# EasyEDA schematic schematic.json
TITLE: Sheet_1; REV: 1.0; Date: 2024-08-02; Sheet: 1/1; Drawn By: aminashellman; Company: Your Company
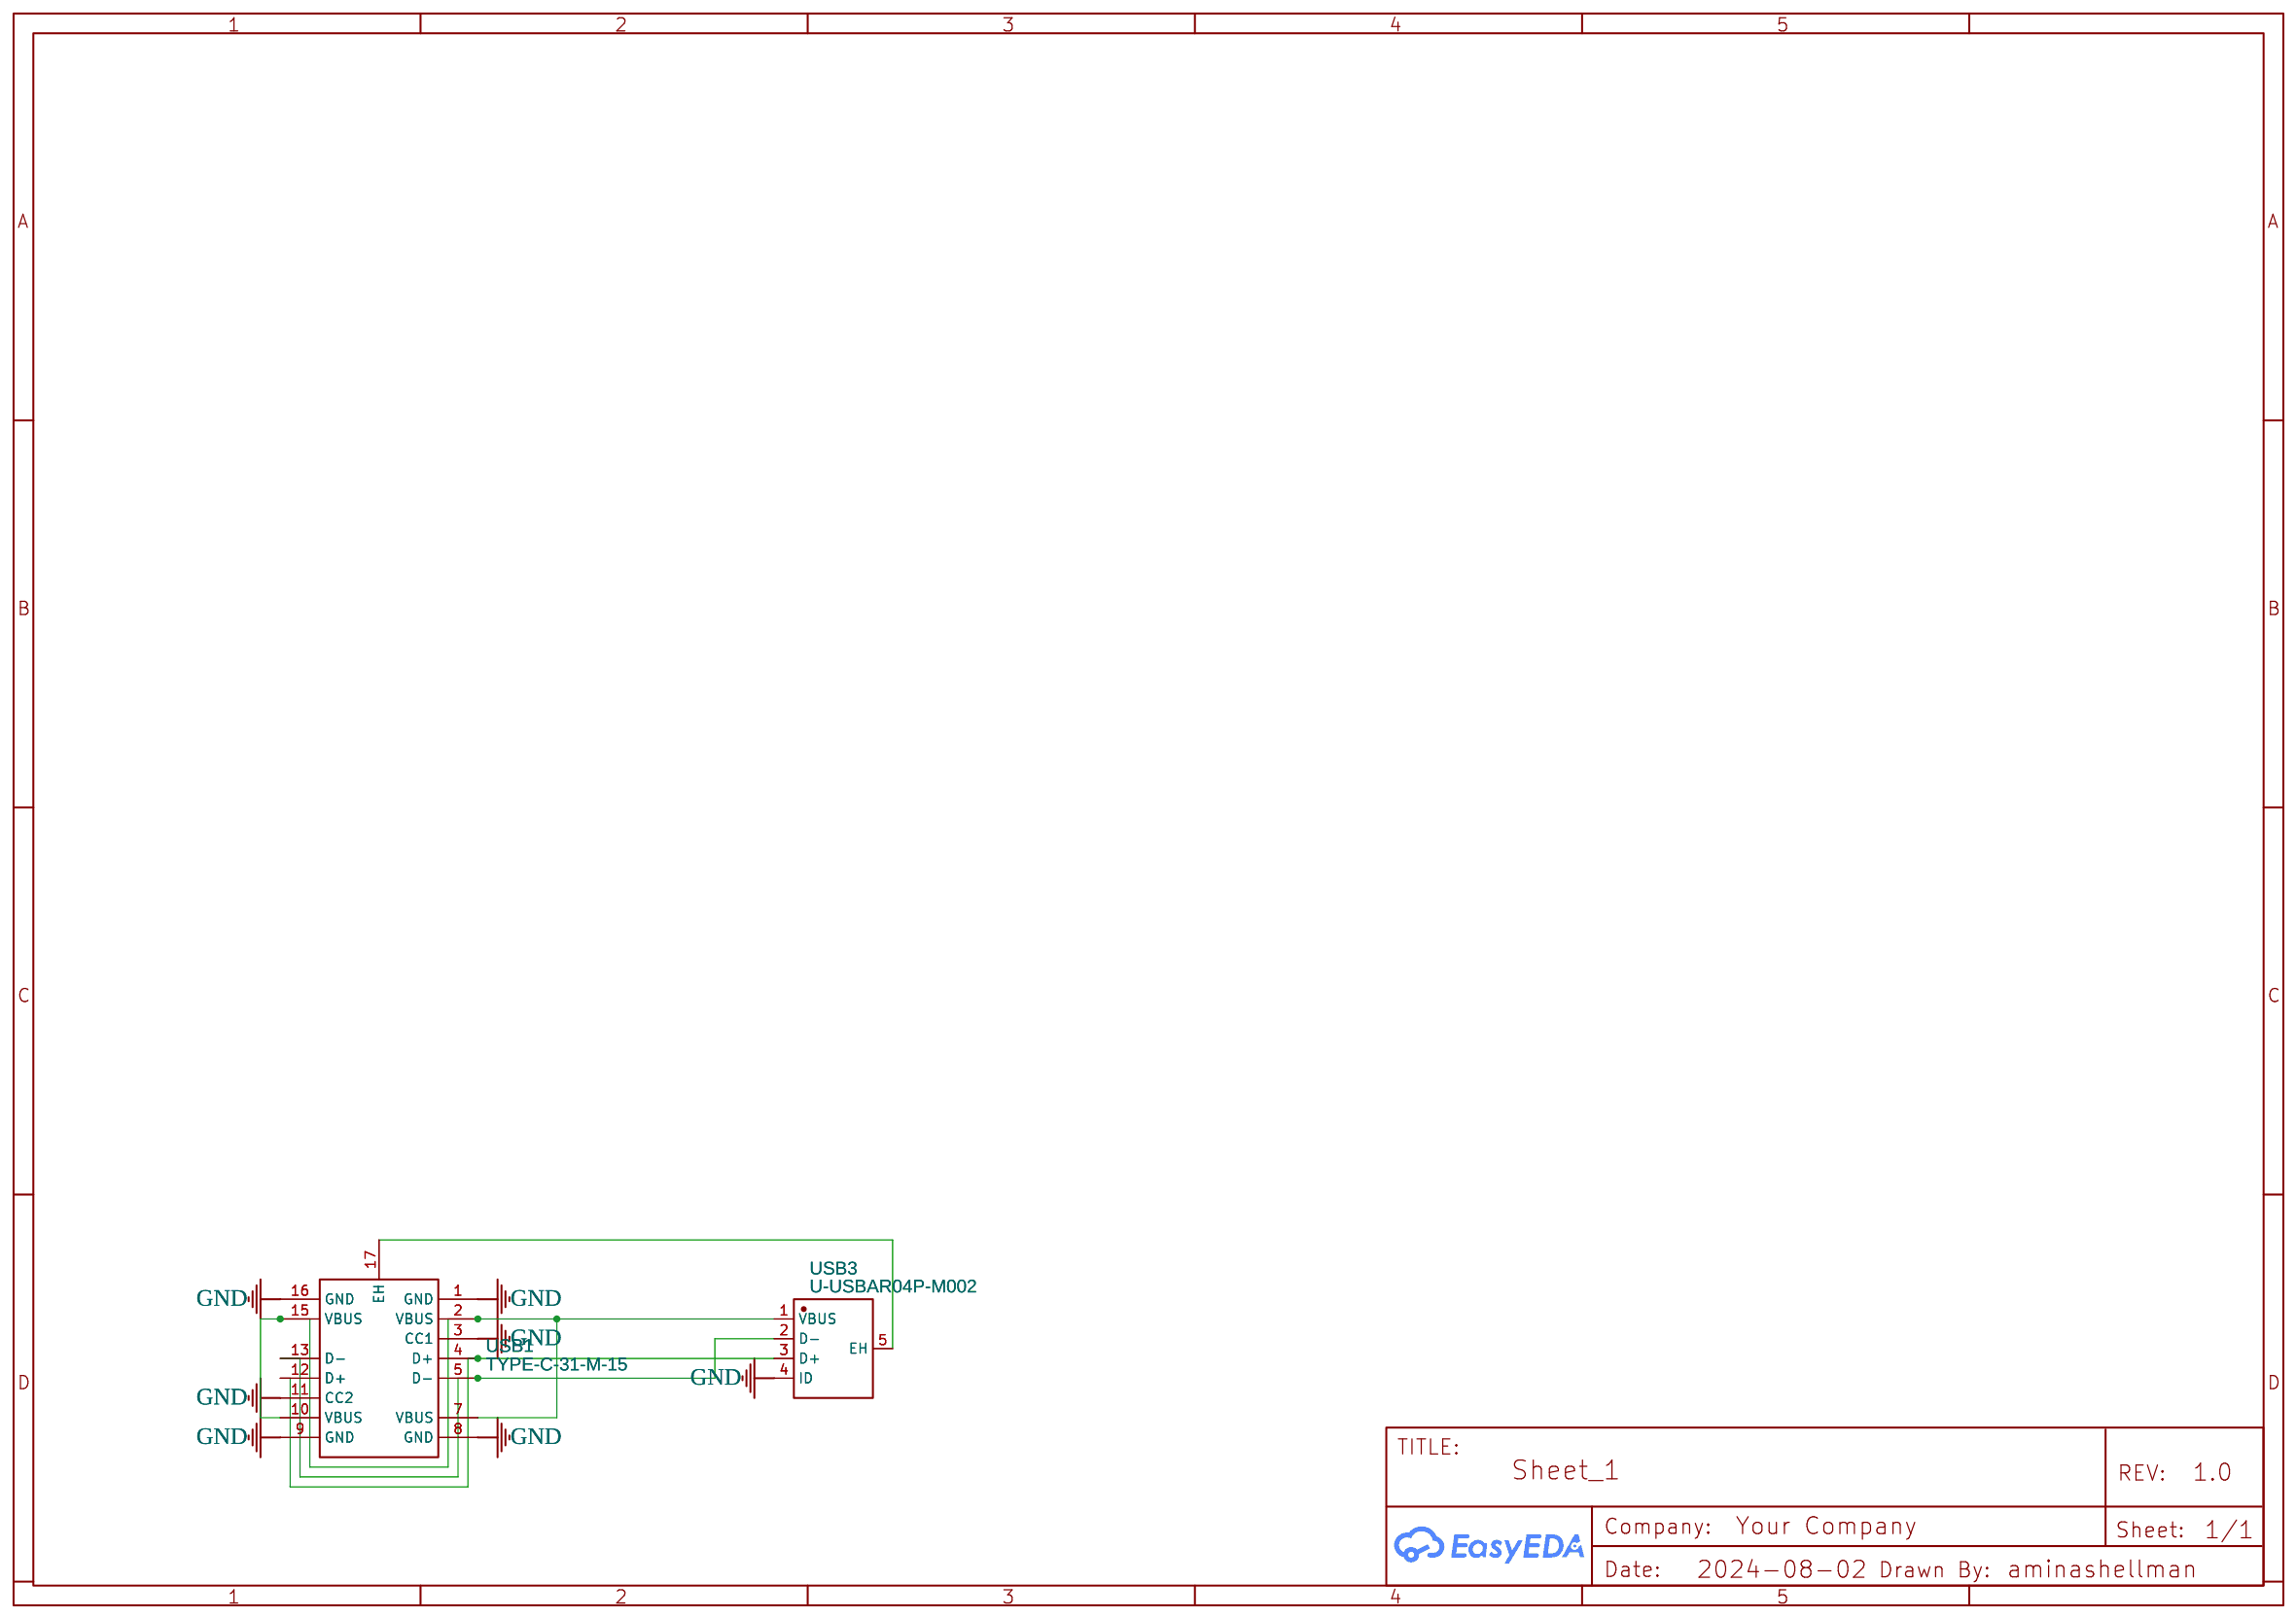
[diagram p0: schematic sheet]

## Parts
USB1  TYPE-C-31-M-15  [USBC-TH_TYPE-C-31-M-15]
USB3  U-USBAR04P-M002  [USB-A-TH_U-USBAR04P-M002]

## Library data of the parts
USB1 = TYPE-C-31-M-15: Contributor: LCSC; Supplier: LCSC; Supplier Part: C223908; Manufacturer: 韩国韩荣; JLCPCB Part Class: Extended Part
USB3 = U-USBAR04P-M002: Contributor: LCSC; Supplier: LCSC; Supplier Part: C386753; Manufacturer: Ckmtw(灿科盟); Manufacturer Part: U-USBAR04P-M001; JLCPCB Part Class: Extended Part

## Nets
GND: USB1.1(GND) USB1.3(CC1) USB1.8(GND) USB1.9(GND) USB1.11(CC2) USB1.16(GND) USB3.4(ID)
Net-(USB1-2): USB1.2(VBUS) USB1.7(VBUS) USB1.10(VBUS) USB1.15(VBUS) USB3.1(VBUS)
Net-(USB1-4): USB1.4(D+) USB1.12(D+) USB3.3(D+)
Net-(USB1-5): USB1.5(D-) USB1.13(D-) USB3.2(D-)
Net-(USB1-17): USB1.17(EH) USB3.5(EH)
